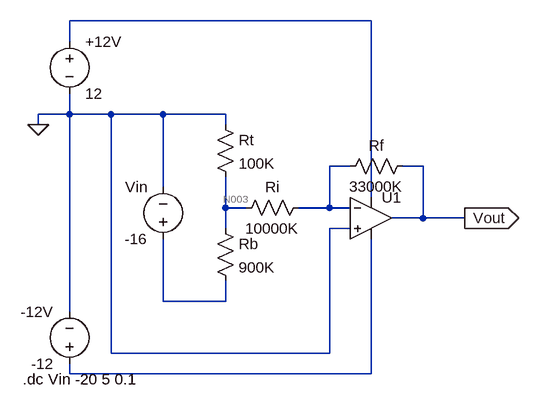
[diagram p0: schematic v-measure-opamp.asc]
v-measure-opamp.asc, the LTspice schematic file:
Version 4
SHEET 1 880 680
WIRE 288 0 -176 0
WIRE -176 32 -176 0
WIRE -176 144 -176 112
WIRE -176 144 -224 144
WIRE -112 144 -176 144
WIRE -32 144 -112 144
WIRE 64 144 -32 144
WIRE -224 160 -224 144
WIRE 64 160 64 144
WIRE 256 224 224 224
WIRE 368 224 336 224
WIRE -32 256 -32 144
WIRE 288 272 288 0
WIRE 64 288 64 240
WIRE 96 288 64 288
WIRE 224 288 224 224
WIRE 224 288 176 288
WIRE 256 288 224 288
WIRE 368 304 368 224
WIRE 368 304 320 304
WIRE 432 304 368 304
WIRE 64 320 64 288
WIRE 256 320 224 320
WIRE -32 432 -32 336
WIRE 64 432 64 400
WIRE 64 432 -32 432
WIRE -176 448 -176 144
WIRE -112 512 -112 144
WIRE 224 512 224 320
WIRE 224 512 -112 512
WIRE -176 544 -176 528
WIRE 288 544 288 336
WIRE 288 544 -176 544
FLAG -224 160 0
FLAG 432 304 Vout
IOPIN 432 304 Out
SYMBOL Opamps\\UniversalOpamp2 288 304 R0
SYMATTR InstName U1
SYMBOL voltage -176 16 R0
SYMATTR InstName +12V
SYMATTR Value 12
SYMBOL voltage -176 544 R180
WINDOW 0 24 96 Left 2
WINDOW 3 24 16 Left 2
SYMATTR InstName -12V
SYMATTR Value -12
SYMBOL res 48 144 R0
SYMATTR InstName Rt
SYMATTR Value 100K
SYMBOL res 48 304 R0
SYMATTR InstName Rb
SYMATTR Value 900K
SYMBOL voltage -32 352 R180
WINDOW 0 24 96 Left 2
WINDOW 3 24 16 Left 2
SYMATTR InstName Vin
SYMATTR Value -16
SYMBOL res 192 272 R90
WINDOW 0 0 56 VBottom 2
WINDOW 3 32 56 VTop 2
SYMATTR InstName Ri
SYMATTR Value 10000K
SYMBOL res 352 208 R90
WINDOW 0 0 56 VBottom 2
WINDOW 3 32 56 VTop 2
SYMATTR InstName Rf
SYMATTR Value 33000K
TEXT -248 552 Left 2 !.dc Vin -20 5 0.1

The netlist it stands for:
* v-measure-opamp.asc
XU1 0 N002 N001 N005 Vout level.2 Avol=1Meg GBW=10Meg Slew=10Meg ilimit=25m rail=0 Vos=0 phimargin=45 en=0 enk=0 in=0 ink=0 Rin=500Meg  ; pins IN+ IN- V+ V- OUT
V§+12V N001 0 12
V§-12V N005 0 -12
Rt 0 N003 100K
Rb N003 N004 900K
Vin N004 0 -16
Ri N002 N003 10000K
Rf Vout N002 33000K
.dc Vin -20 5 0.1
.lib UniversalOpamps2.sub
.backanno
.end

* Results of the author's LTspice run, read from the files saved beside the schematic
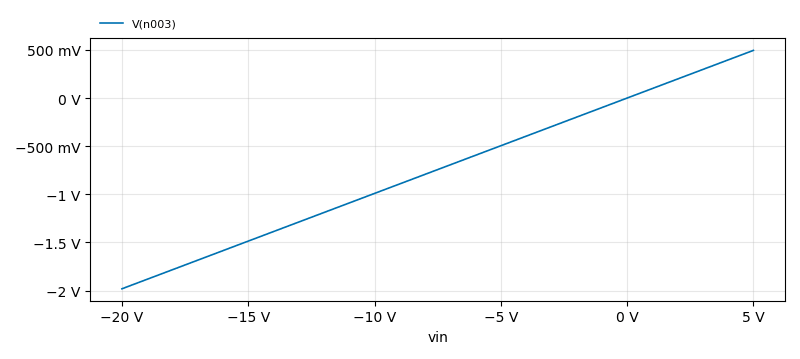
[diagram p1: DC transfer characteristic of v-measure-opamp.asc, plotted from the saved traces]
* DC transfer characteristic, 1 run:
*   V(n003): -1.982 V at vin=-20 V, 495.5 mV at vin=5 V, min -1.982 V, max 495.5 mV